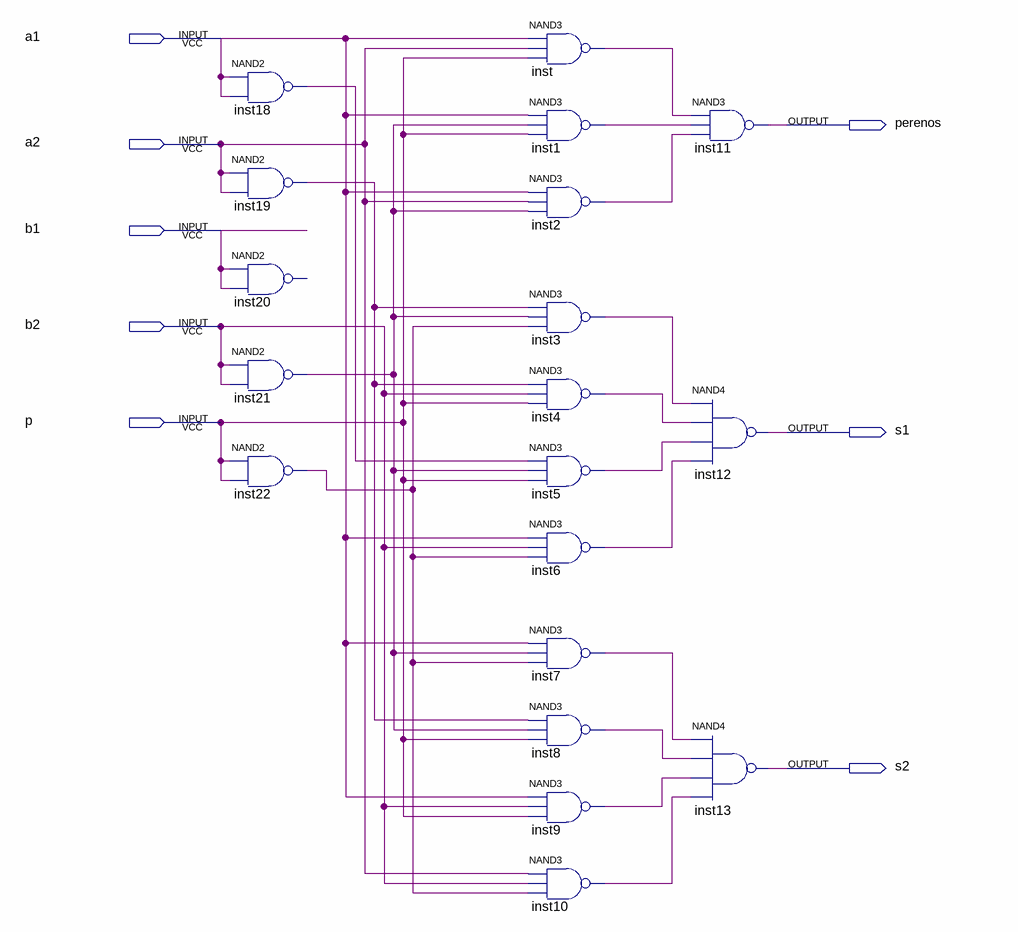
[diagram p0: schematic sheet]
// Quartus schematic kuravaya.bdf as structural Verilog: 19 symbols, 8 pins
module kuravaya (
  input  a1,
  input  a2,
  input  b1,
  input  b2,
  input  p,
  output perenos,
  output s1,
  output s2
);

  wire inst1_out, inst2_out, inst3_out, inst4_out, inst5_out, inst6_out, inst7_out, inst8_out, inst9_out,
       inst10_out, inst18_out, inst19_out, inst21_out, inst22_out, inst_out;

  nand inst18 (inst18_out, a1, a1);
  nand inst19 (inst19_out, a2, a2);
  // NAND2 inst20 has open pins: IN1=b1, IN2=b1, OUT=open
  nand inst21 (inst21_out, b2, b2);
  nand inst22 (inst22_out, p, p);
  nand inst (inst_out, a1, a2, p);
  nand inst1 (inst1_out, a1, inst21_out, p);
  nand inst2 (inst2_out, a1, a2, inst21_out);
  nand inst3 (inst3_out, inst19_out, inst21_out, inst22_out);
  nand inst4 (inst4_out, inst19_out, b2, p);
  nand inst5 (inst5_out, inst18_out, inst21_out, p);
  nand inst6 (inst6_out, a1, b2, inst22_out);
  nand inst7 (inst7_out, a1, inst21_out, inst22_out);
  nand inst8 (inst8_out, inst19_out, inst21_out, p);
  nand inst9 (inst9_out, a1, b2, p);
  nand inst10 (inst10_out, a2, b2, inst22_out);
  nand inst11 (perenos, inst_out, inst1_out, inst2_out);
  nand inst12 (s1, inst3_out, inst4_out, inst5_out, inst6_out);
  nand inst13 (s2, inst7_out, inst8_out, inst9_out, inst10_out);
endmodule
